# EAGLE design Biphase (EAGLE 9.4.2)
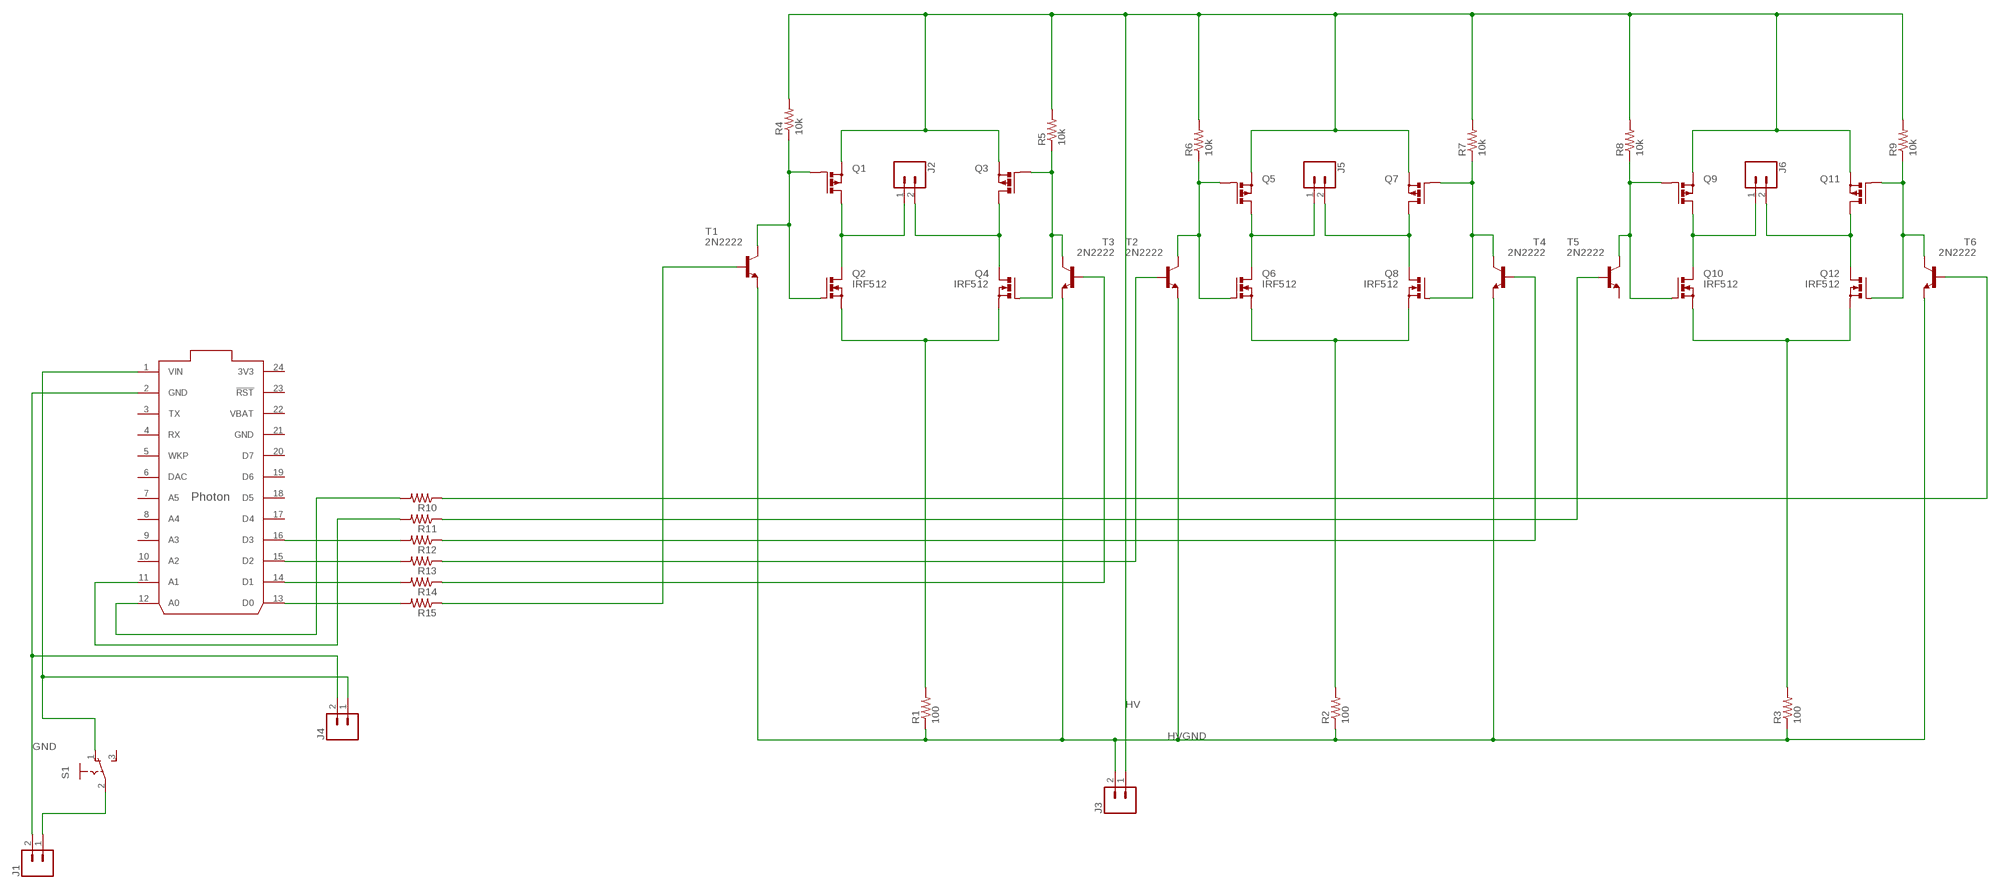
[diagram p0: schematic, sheet 1]

## Parts
J1  CONN_02LOCK_LONGPADS  [1X02_LOCK_LONGPADS]
J2  CONN_02POLAR_LOCK  [MOLEX-1X2_LOCK]
J3  CONN_02POLAR_LOCK  [MOLEX-1X2_LOCK]
J4  CONN_02POLAR_LOCK  [MOLEX-1X2_LOCK]
J5  CONN_02POLAR_LOCK  [MOLEX-1X2_LOCK]
J6  CONN_02POLAR_LOCK  [MOLEX-1X2_LOCK]
Q1  PMOSFET_PTO220BV  [TO220BV]
Q2  IRF512  [TO220BV]
Q3  PMOSFET_PTO220BV  [TO220BV]
Q4  IRF512  [TO220BV]
Q5  PMOSFET_PTO220BV  [TO220BV]
Q6  IRF512  [TO220BV]
Q7  PMOSFET_PTO220BV  [TO220BV]
Q8  IRF512  [TO220BV]
Q9  PMOSFET_PTO220BV  [TO220BV]
Q10  IRF512  [TO220BV]
Q11  PMOSFET_PTO220BV  [TO220BV]
Q12  IRF512  [TO220BV]
R1  100  R-US_0204/7  [0204/7]
R2  100  R-US_0204/7  [0204/7]
R3  100  R-US_0204/7  [0204/7]
R4  10k  R-US_0204/7  [0204/7]
R5  10k  R-US_0204/7  [0204/7]
R6  10k  R-US_0204/7  [0204/7]
R7  10k  R-US_0204/7  [0204/7]
R8  10k  R-US_0204/7  [0204/7]
R9  10k  R-US_0204/7  [0204/7]
R10  R-US_0204/7  [0204/7]
R11  R-US_0204/7  [0204/7]
R12  R-US_0204/7  [0204/7]
R13  R-US_0204/7  [0204/7]
R14  R-US_0204/7  [0204/7]
R15  R-US_0204/7  [0204/7]
S1  255SB  [255SB]
T1  2N2222  [TO18]
T2  2N2222  [TO18]
T3  2N2222  [TO18]
T4  2N2222  [TO18]
T5  2N2222  [TO18]
T6  2N2222  [TO18]
U$1  PHOTON_WITH_HEADERS  [PHOTON]

## Nets
GND: J1.2 J4.2 U$1.2(GND)
HV: J3.1 Q1.S Q3.S Q5.S Q7.S Q9.S Q11.S R4.2 R5.2 R6.2 R7.2 R8.2 R9.2
HVGND: J3.2 R1.1 R2.1 R3.1 T1.1(E) T2.1(E) T3.1(E) T4.1(E) T6.1(E)
N$1: J2.1 Q1.D Q2.D
N$2: J2.2 Q3.D Q4.D
N$3: Q5.G Q6.G R6.1 T2.3(C)
N$4: Q1.G Q2.G R4.1 T1.3(C)
N$5: Q2.S Q4.S R1.2
N$6: Q3.G Q4.G R5.1 T3.3(C)
N$7: Q7.G Q8.G R7.1 T4.3(C)
N$8: R15.1 T1.2(B)
N$9: Q11.G Q12.G R9.1 T6.3(C)
N$10: Q9.G Q10.G R8.1 T5.3(C)
N$11: J4.1 S1.1(O) U$1.1(VIN)
N$12: J5.1 Q5.D Q6.D
N$13: J5.2 Q7.D Q8.D
N$14: J1.1 S1.2(P)
N$15: Q6.S Q8.S R2.2
N$16: R14.1 T3.2(B)
N$17: R13.1 T2.2(B)
N$18: R12.1 T4.2(B)
N$19: R11.1 T5.2(B)
N$20: J6.1 Q9.D Q10.D
N$21: J6.2 Q11.D Q12.D
N$22: R10.1 T6.2(B)
N$23: Q10.S Q12.S R3.2
N$24: R11.2 U$1.11(A1)
N$25: R10.2 U$1.12(A0)
N$26: R12.2 U$1.16(D3)
N$27: R13.2 U$1.15(D2)
N$28: R14.2 U$1.14(D1)
N$29: R15.2 U$1.13(D0)
Unconnected: S1.3(S) T5.1(E) U$1.3(TX) U$1.4(RX) U$1.5(WKP) U$1.6(DAC) U$1.7(A5) U$1.8(A4) U$1.9(A3) U$1.10(A2) U$1.17(D4) U$1.18(D5) U$1.19(D6) U$1.20(D7) U$1.23(!RST)

## Power pins joined to a net without a drawn wire
3V3: U$1.24(3V3)
GND: U$1.21(GND)
VBAT: U$1.22(VBAT)

## Library data of the parts
J1 = SparkFun-Connectors:CONN_02: Multi connection point. Often used as Generic Header-pin footprint for 0.1 inch spaced/style header connections On any of the 0.1 inch spaced packages, you can populate with these: Break Away Headers - Straight <https://www.sparkfun.com/products/116> (PRT-00116) Break Away Male Headers - Right Angle <https://www.sparkfun.com/products/553> (PRT-00553) Female Headers <https://www.sparkfun.com/products/115> (PRT-00115) Break Away Headers - Machine Pin <https://www.sparkfun.com/products/117> (PRT-00117) Break Away Female Headers - Swiss Machine Pin <https://www.sparkfun.com/products/743> (PRT-00743) For SCREWTERMINALS and SPRING TERMINALS visit here: Screw Terimnals on SparkFun.com <https://www.sparkfun.com/search/results?term=Screw+Terminals> (5mm/3.5mm/2.54mm spacing) This device is also useful as a general connection point to wire up your design to another part of your project. Our various solder wires solder well into these plated through hole pads. Hook-Up Wire - Assortment (Stranded, 22 AWG) <https://www.sparkfun.com/products/11375> (PRT-11375) Hook-Up Wire - Assortment (Solid Core, 22 AWG) <https://www.sparkfun.com/products/11367> (PRT-11367) View the entire wire category on our website here <https://www.sparkfun.com/categories/141> Special notes: Molex polarized connector foot print use with: PRT-08233 with associated crimp pins and housings. 2.54_SCREWTERM for use with PRT-10571. 3.5mm Screw Terminal footprints for PRT-08084 5mm Screw Terminal footprints for use with PRT-08432
J2-J6 = SparkFun-Connectors:CONN_02: Multi connection point. Often used as Generic Header-pin footprint for 0.1 inch spaced/style header connections On any of the 0.1 inch spaced packages, you can populate with these: Break Away Headers - Straight <https://www.sparkfun.com/products/116> (PRT-00116) Break Away Male Headers - Right Angle <https://www.sparkfun.com/products/553> (PRT-00553) Female Headers <https://www.sparkfun.com/products/115> (PRT-00115) Break Away Headers - Machine Pin <https://www.sparkfun.com/products/117> (PRT-00117) Break Away Female Headers - Swiss Machine Pin <https://www.sparkfun.com/products/743> (PRT-00743) For SCREWTERMINALS and SPRING TERMINALS visit here: Screw Terimnals on SparkFun.com <https://www.sparkfun.com/search/results?term=Screw+Terminals> (5mm/3.5mm/2.54mm spacing) This device is also useful as a general connection point to wire up your design to another part of your project. Our various solder wires solder well into these plated through hole pads. Hook-Up Wire - Assortment (Stranded, 22 AWG) <https://www.sparkfun.com/products/11375> (PRT-11375) Hook-Up Wire - Assortment (Solid Core, 22 AWG) <https://www.sparkfun.com/products/11367> (PRT-11367) View the entire wire category on our website here <https://www.sparkfun.com/categories/141> Special notes: Molex polarized connector foot print use with: PRT-08233 with associated crimp pins and housings. 2.54_SCREWTERM for use with PRT-10571. 3.5mm Screw Terminal footprints for PRT-08084 5mm Screw Terminal footprints for use with PRT-08432; SF_ID: PRT-09918
Q1 Q3 Q5 Q7 Q9 Q11 = transistor-power:PMOSFET_P: Power MOSFET P-Channel
Q2 Q4 Q6 Q8 Q10 Q12 = transistor-power:IRF512: N-CHANNEL MOS FET
R1-R15 = rcl:R-US_: RESISTOR, American symbol; SPICEPREFIX: R
S1 = switch:255SB: SLIDING SWITCH Distributor Buerklin, 11G810
T1-T6 = transistor:2N2222: NPN TRANSISTOR
U$1 = Particle-Devices:PHOTON: Particle Photon Wi-Fi through-hole development board footprint Product datasheet: here <https://docs.particle.io/datasheets/photon-(wifi)/photon-datasheet/> Design files: here <https://github.com/particle-iot/photon> Github : Particle devices library <https://github.com/particle-iot/hardware-libraries/tree/master/Eagle>

## Board
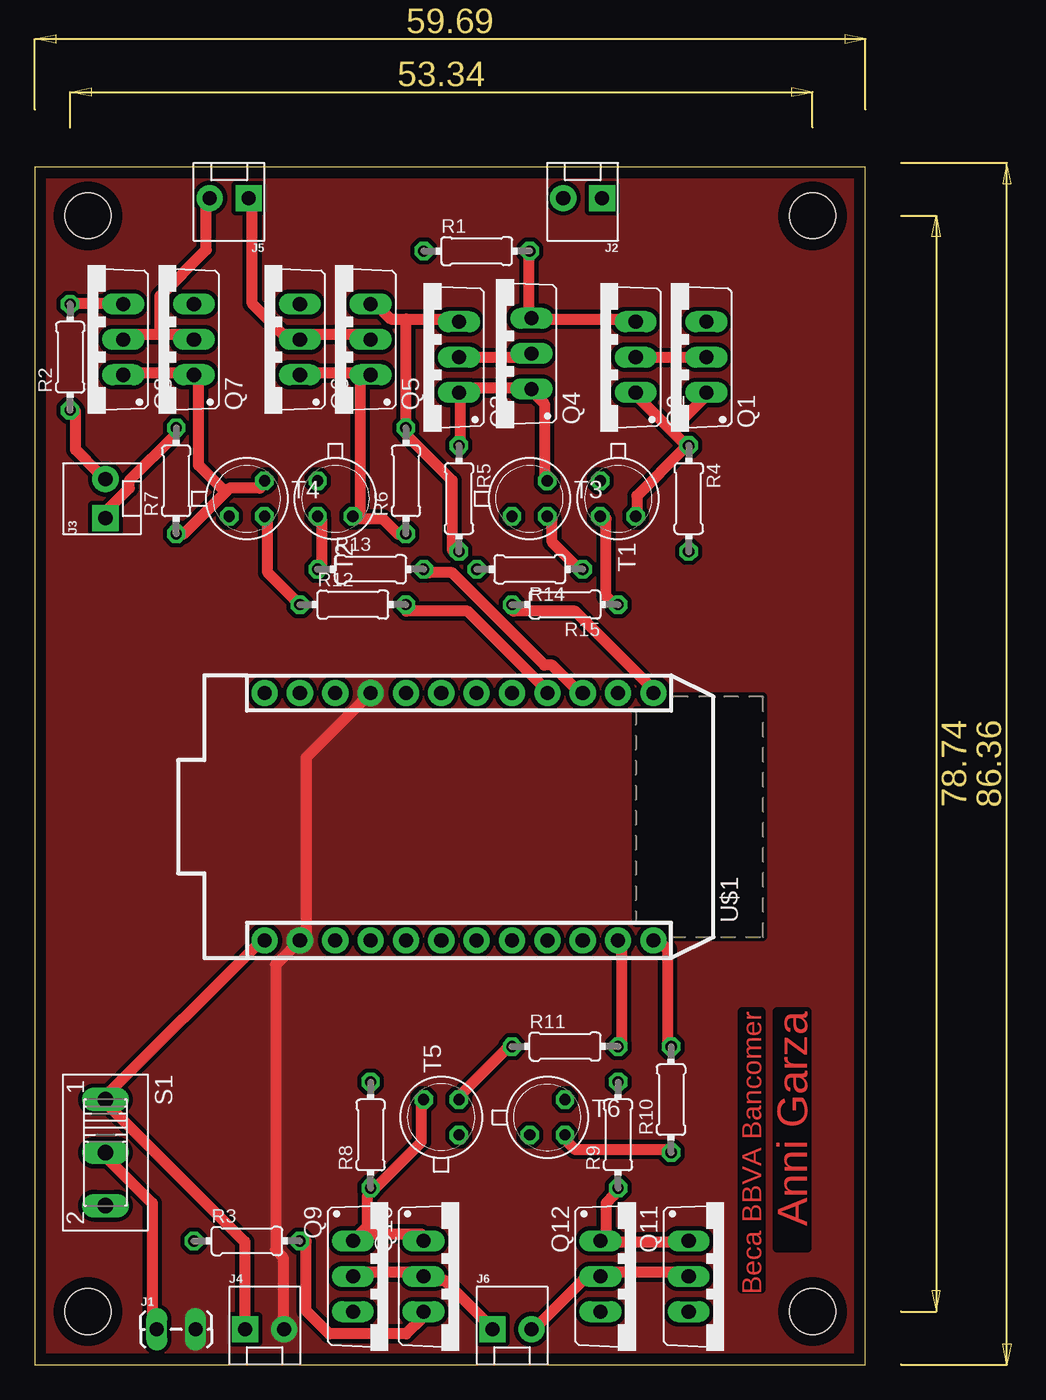
[diagram p1: board, top side]
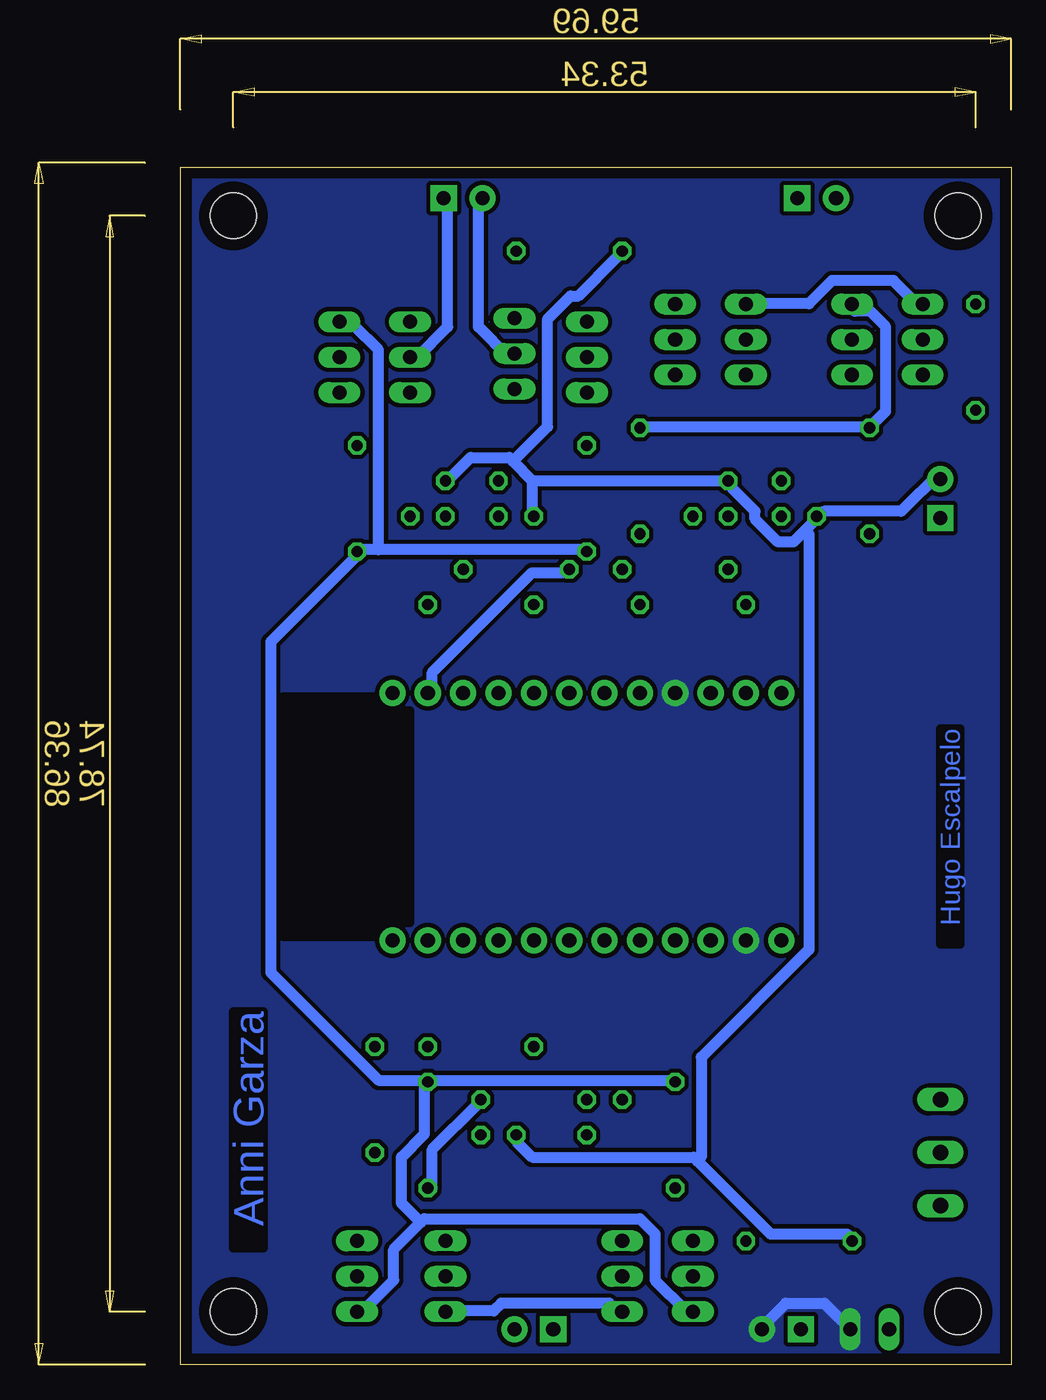
[diagram p2: board, bottom side, seen from below]

Size 59.67 x 86.03 mm. Coordinates in mm from the lower left corner, seen from the top.
Outline: 0,0 59.67,0 59.67,86.03 0,86.03 0,0
Copper layers (1*16): Top 0.035mm / dielectric 1.5mm / Bottom 0.035mm
Design rules "default *": minimum track width 0.8mm, minimum drill 0.35mm, track to track 12mil, track to pad 12mil, pad to pad 12mil, via to via 12mil, smd to smd 12mil, copper to edge 32mil, drill to drill 12mil, minimum pad ring 10mil, minimum via ring 8mil, stop-mask expansion 4mil, vias tented up to drill 0mil, thermal gap 10mil
Holes 3.3 mm at 55.88,3.81 3.81,82.55 55.88,82.55 3.81,3.81

### Footprints (pad centres in the part's own frame; a part is rotated, then mirrored left to right if it is on the bottom)
1X02_LOCK_LONGPADS = drill 1.016 long: 1 -0.127,0; 2 2.667,0
MOLEX-1X2_LOCK = drill 1.016 pad 1.88 square: 1 -0.127,0 | drill 1.016 pad 1.88: 2 2.667,0
TO220BV = drill 1.016 long: D 0,-2.54; G -2.54,-2.54; S 2.54,-2.54
0204/7 = drill 0.813 octagon: 1 -3.81,0; 2 3.81,0
255SB = drill 1.118 long: 1 -3.81,0; 2 0,0; 3 3.81,0
TO18 = drill 0.813 octagon: 1 -1.27,-1.27; 2 1.27,-1.27; 3 1.27,1.27
PHOTON = drill 1.016 pad 1.88: 1 1.27,33.02; 2 1.27,30.48; 3 1.27,27.94; 4 1.27,25.4; 5 1.27,22.86; 6 1.27,20.32; 7 1.27,17.78; 8 1.27,15.24; 9 1.27,12.7; 10 1.27,10.16; 11 1.27,7.62; 12 1.27,5.08; 13 19.05,5.08; 14 19.05,7.62; 15 19.05,10.16; 16 19.05,12.7; 17 19.05,15.24; 18 19.05,17.78; 19 19.05,20.32; 20 19.05,22.86; 21 19.05,25.4; 22 19.05,27.94; 23 19.05,30.48; 24 19.05,33.02

### Placement (x,y rotation side)
J1  8.89,2.54 0 top
J2  40.64,83.82 180 top
J3  5.08,60.96 90 top
J4  15.24,2.54 0 top
J5  15.24,83.82 180 top
J6  33.02,2.54 0 top
Q1  45.72,72.39 90 top
Q2  40.64,72.39 90 top
Q3  27.94,72.39 90 top
Q4  33.15,72.64 90 top
Q5  21.59,73.66 90 top
Q6  16.51,73.66 90 top
Q7  8.89,73.66 90 top
Q8  3.81,73.66 90 top
Q9  25.4,6.35 270 top
Q10  30.48,6.35 270 top
Q11  49.53,6.35 270 top
Q12  43.18,6.35 270 top
R1  31.75,80.01 0 top
R2  2.54,72.39 90 top
R3  15.24,8.89 0 top
R4  46.99,62.23 270 top
R5  30.48,62.23 270 top
R6  26.67,63.5 90 top
R7  10.16,63.5 90 top
R8  24.13,16.51 90 top
R9  41.91,16.51 90 top
R10  45.72,19.05 90 top
R11  38.1,22.86 0 top
R12  22.86,54.61 0 top
R13  24.13,57.15 0 top
R14  35.56,57.15 180 top
R15  38.1,54.61 180 top
S1  5.08,15.24 270 top
T1  41.91,62.23 270 top
T2  21.59,62.23 270 top
T3  35.56,62.23 0 top
T4  15.24,62.23 0 top
T5  29.21,17.78 90 top
T6  36.83,17.78 0 top
U$1  49.53,29.21 90 top

### Tracks (layer width: path | path; a pad name or v marks a point on that pad's centre or on a via)
GND
  Top 0.8: U$1.21 23.92,48.06 19.5,43.64 19.5,30.93 U$1.2 18.95,30.38 17.29,28.73 17.29,8.29 17.84,7.73 17.84,2.76 J4.2
  Bottom 0.8: J1.2 11.77,2.76 13.42,4.42 16.18,4.42 17.84,2.76 J4.2
  pour Bottom (isolate 0.305, no thermals): 0,86.36 59.69,86.36 59.69,0 0,0
  pour Top (isolate 0.305, no thermals): 0,86.36 59.69,86.36 59.69,0 0,0 0,85.09
HV
  Top 0.8: R7.2 10.11,66.84 6.79,63.53 6.79,62.97 5.14,61.32 J3.1 | 26.68,75.13 25.58,75.13 24.47,76.23 Q5.S | 26.68,75.13 30,75.13 Q3.S | R5.2 30,58.55 30,63.53 26.68,66.84 R6.2 26.68,67.39 26.68,75.13
  Bottom 0.8: R8.2 24.47,20.44 41.6,20.44 R9.2 | 42.42,10.22 44.36,8.29 44.36,6.08 46.57,3.87 Q11.S | 42.42,10.22 42.15,10.5 26.68,10.5 25.58,9.39 25.58,6.08 23.37,3.87 Q9.S | 42.42,10.22 43.8,11.6 43.8,14.91 42.15,16.57 42.15,19.89 R9.2 | Q7.S 11.21,75.68 10.11,75.68 9,74.57 9,68.5 10.11,67.39 R7.2 10.66,67.39 26.13,67.39 R6.2 | 45.46,58.55 30.55,58.55 R5.2 | 45.46,58.55 46.57,58.55 R4.2 47.12,58 53.2,51.93 53.2,28.17 45.46,20.44 42.15,20.44 R9.2 | 45.46,58.55 45.46,72.92 47.12,74.57 48.22,74.57 Q1.S
HVGND
  Top 0.8: R2.1 2.93,68.5 2.93,65.74 4.58,64.08 J3.2
  Bottom 0.8: 22.54,14.64 22.81,14.91 34.41,14.91 35.52,16.02 T6.1 | 22.54,14.64 17.29,9.39 11.77,9.39 R3.1 | J3.2 5.14,64.08 7.9,61.32 13.42,61.32 T4.1 13.97,60.76 14.8,59.94 | 14.8,59.94 15.63,59.11 16.74,59.11 18.39,60.76 18.39,61.32 20.05,62.97 T2.1 20.6,63.53 34.41,63.53 | 34.41,63.53 34.41,61.32 T3.1 | 35.8,64.91 36.07,65.18 38.83,65.18 40.49,63.53 T1.1 | 35.8,64.91 34.41,63.53 | 35.8,64.91 33.31,67.39 33.31,75.13 31.65,76.78 31.1,76.78 28.34,79.55 R1.1 | 22.54,14.64 22.26,14.91 22.26,22.1 14.53,29.83 14.53,59.66 14.8,59.94
N$1
  Top 0.8: Q2.D 43.25,72.36 48.22,72.36 Q1.D
  Bottom 0.8: J2.1 40.49,83.41 40.49,74.57 42.7,72.36 Q2.D
N$2
  Top 0.8: Q3.D 30.55,72.36 35.52,72.36 Q4.D
  Bottom 0.8: J2.2 38.28,83.41 38.28,74.57 36.07,72.36 Q4.D
N$3
  Top 0.8: R6.1 26.13,59.66 25.02,60.76 23.37,60.76 T2.3 23.37,61.32 23.37,71.26 | 23.37,71.26 23.92,71.26 Q5.G 23.37,71.26 | 23.37,71.26 19.5,71.26 Q6.G
N$4
  Top 0.8: T1.3 43.25,61.32 43.25,62.42 46.57,65.74 R4.1 46.57,66.29 45.74,67.12 | 45.74,67.12 43.25,69.6 Q2.G | 45.74,67.12 48.22,69.6 Q1.G
N$5
  Top 0.8: R1.2 35.52,79.55 35.52,75.68 Q4.S 36.07,75.13 42.7,75.13 Q2.S
N$6
  Top 0.8: R5.1 30.55,66.29 30.55,69.6 Q3.G 30.55,70.16 35.52,70.16 Q4.G 36.07,69.6 36.62,69.05 36.62,63.53 T3.3
N$7
  Top 0.8: Q8.G 6.79,71.26 11.21,71.26 Q7.G 11.77,70.71 11.77,64.63 13.7,62.7 | 13.7,62.7 13.97,62.97 16.18,62.97 T4.3 | 13.7,62.7 10.66,59.66 R7.1
N$8
  Top 0.8: T1.2 41.04,60.76 41.04,55.24 41.6,54.69 R15.1
N$9
  Top 0.8: R9.1 41.6,12.15 41.04,11.6 41.04,9.39 Q12.G 41.04,8.84 46.57,8.84 Q11.G
  Bottom 0.8: T6.3 38.28,18.78 41.6,15.47 41.6,12.71 R9.1
N$10
  Top 0.8: T5.3 27.79,18.78 27.79,16.02 24.47,12.71 R8.1 23.92,12.15 23.92,9.94 23.37,9.39 Q9.G 23.92,9.39 27.79,9.39 Q10.G
N$11
  Top 0.8: U$1.1 16.18,30.38 5.14,19.33 S1.1 5.14,18.78 15.08,8.84 15.08,2.76 J4.1
N$12
  Top 0.8: Q5.D 23.92,74.02 19.5,74.02 Q6.D 18.95,74.02 17.84,74.02 15.63,76.23 15.63,83.41 J5.1
N$13
  Top 0.8: 9,74.02 11.21,74.02 Q7.D | 9,74.02 6.79,74.02 Q8.D | 9,74.02 9,76.78 12.32,80.1 12.32,83.41 J5.2
N$14
  Top 0.8: J1.1 8.45,2.76 8.45,11.6 5.14,14.91 S1.2
N$15
  Top 0.8: R2.2 2.93,76.23 6.24,76.23 Q8.S
  Bottom 0.8: Q6.S 18.95,76.23 14.53,76.23 12.87,77.89 8.45,77.89 6.79,76.23 Q8.S
N$16
  Top 0.8: T3.2 37.18,60.76 37.18,59.11 38.83,57.45 R14.1
N$17
  Top 0.8: R13.1 20.6,57.45 20.6,60.76 T2.2
N$18
  Top 0.8: T4.2 16.74,60.76 16.74,56.9 18.95,54.69 R12.1
N$19
  Top 0.8: T5.2 30.55,19.33 33.86,22.65 R11.1
N$20
  Top 0.8: Q9.D 23.37,6.63 27.79,6.63 Q10.D 28.34,6.08 29.44,6.08 32.76,2.76 J6.1
N$21
  Top 0.8: Q11.D 46.57,6.63 41.04,6.63 Q12.D 40.49,6.08 39.39,6.08 36.07,2.76 J6.2
N$22
  Top 0.8: R10.1 45.46,15.47 38.83,15.47 38.28,16.02 T6.2
N$23
  Top 0.8: R3.2 19.5,8.84 19.5,3.87 21.16,2.21 26.68,2.21 27.79,3.31 Q10.S
  Bottom 0.8: Q12.S 40.49,3.87 37.18,3.87 36.62,4.42 28.89,4.42 28.34,3.87 Q10.S
N$24
  Top 0.8: R11.2 42.15,23.2 42.15,30.38 U$1.11
N$25
  Top 0.8: R10.2 45.46,23.2 45.46,29.83 44.91,30.38 U$1.12
N$26
  Top 0.8: R12.2 26.68,54.13 31.1,54.13 36.62,48.61 U$1.16
N$27
  Top 0.8: R13.2 28.34,56.9 30,56.9 36.62,50.27 37.18,50.27 38.83,48.61 U$1.15
N$28
  Bottom 0.8: R14.2 32.2,56.9 34.41,56.9 41.6,49.72 41.6,48.61 U$1.14
N$29
  Top 0.8: R15.2 34.41,54.13 38.83,54.13 44.36,48.61 U$1.13

### Text on the board
Top: Beca BBVA Bancomer | Anni Garza
Bottom: Hugo Escalpelo | Anni Garza